# EAGLE design GaN-amplifier (EAGLE 7.7.0)

## Sheet 1 of 2
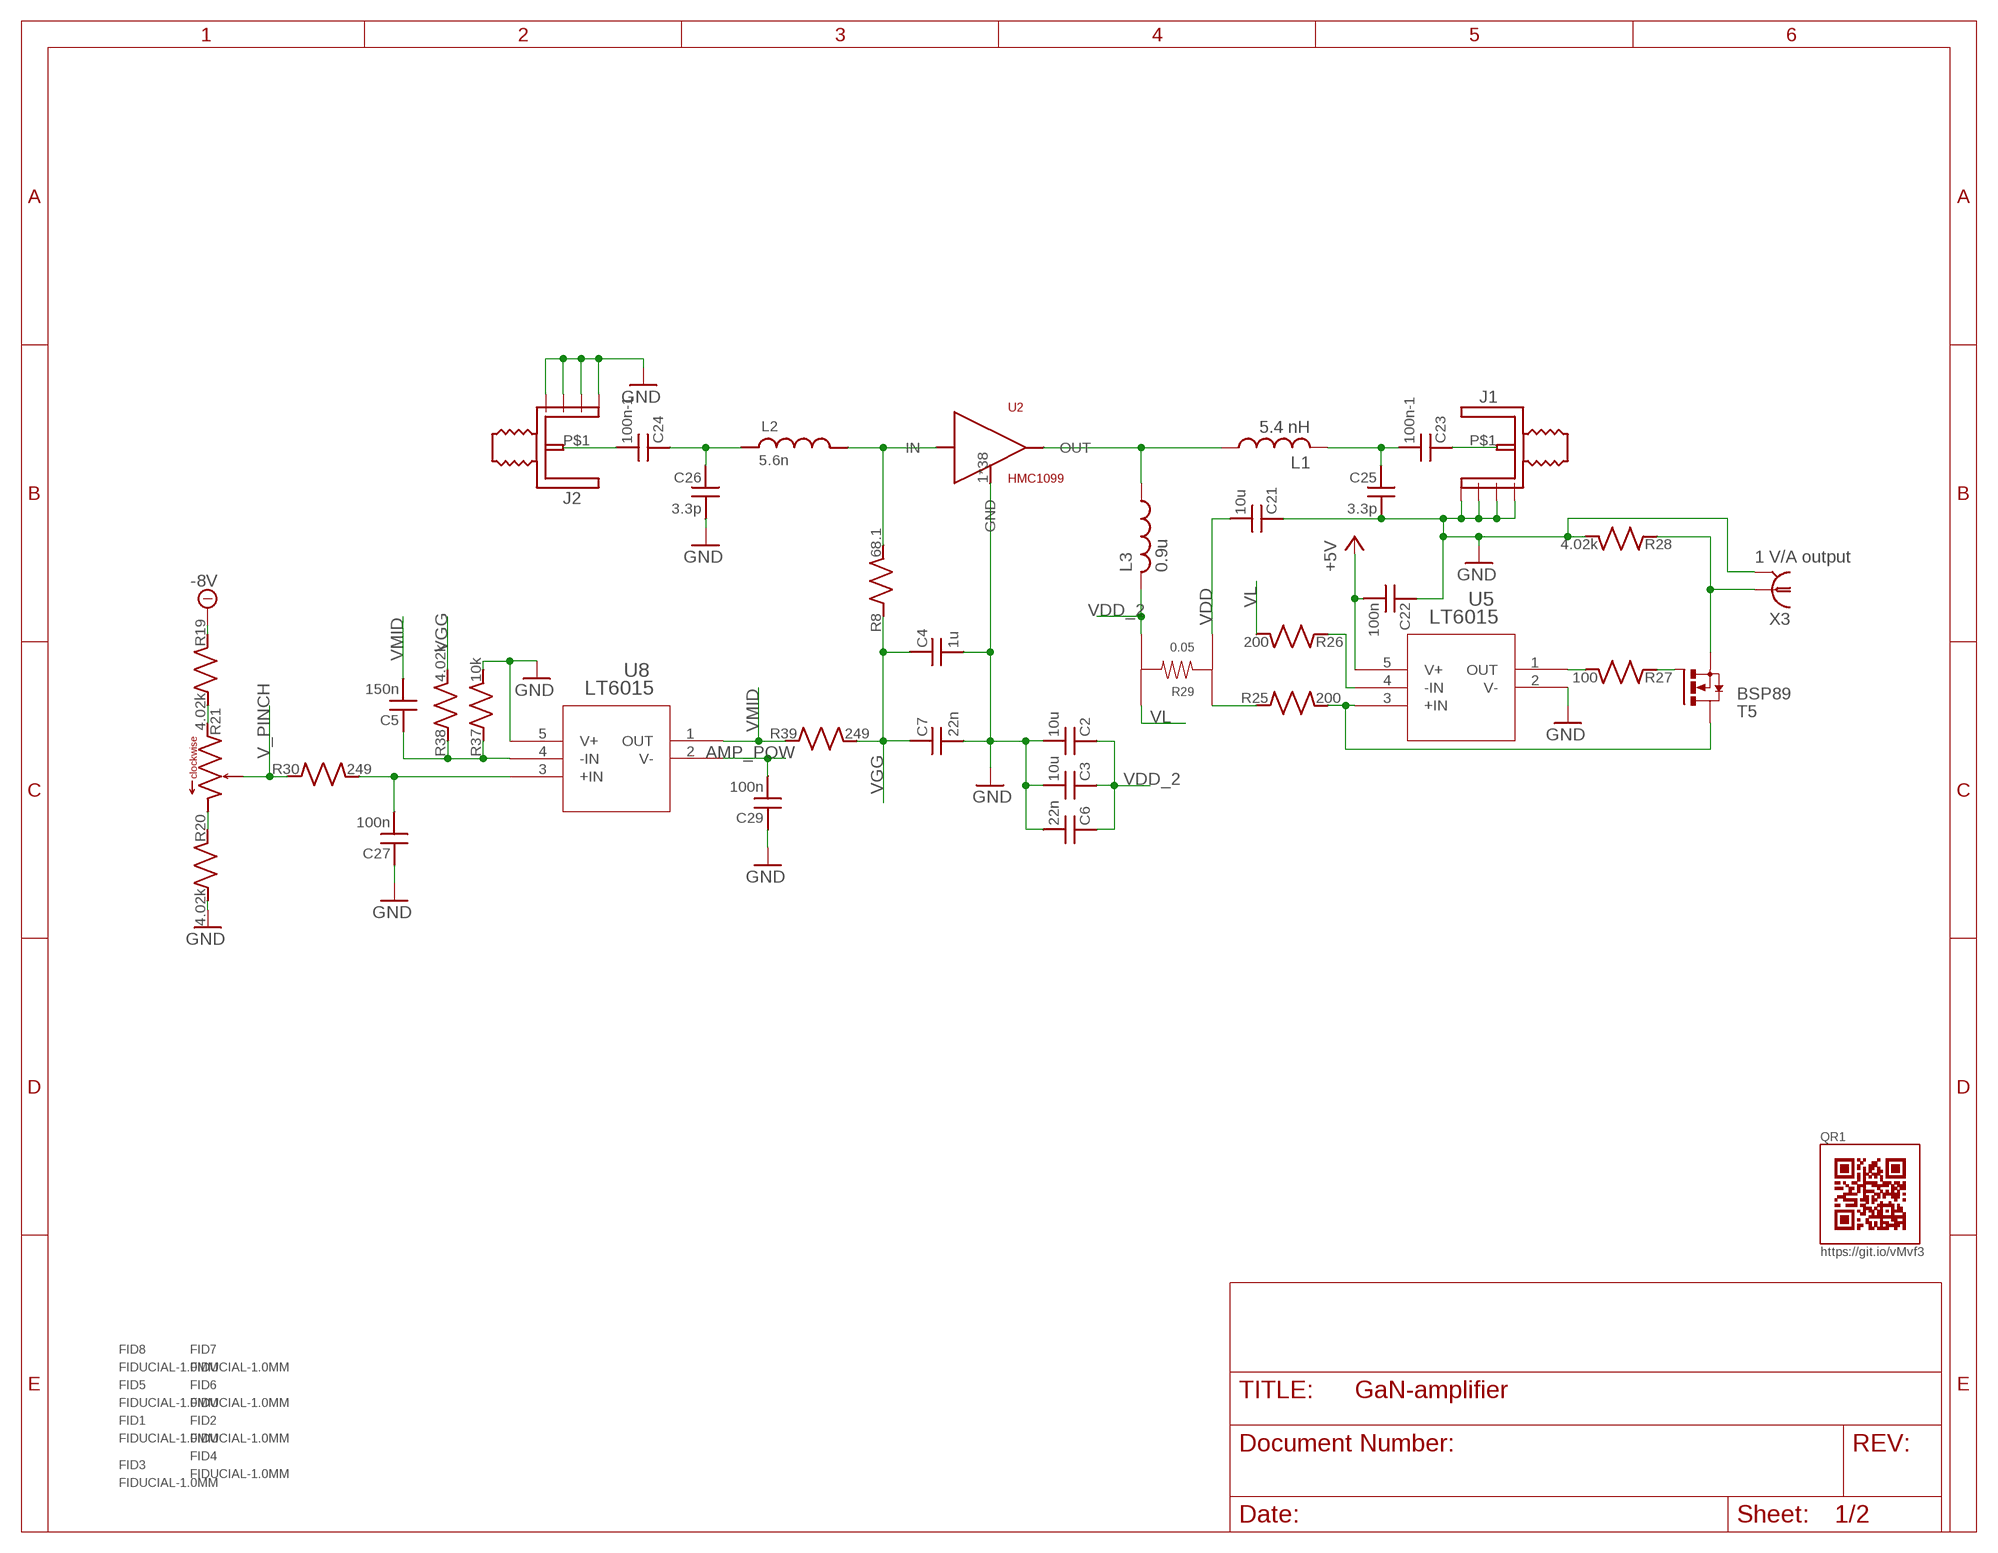
[diagram p0: schematic, sheet 1]

### Parts
C2  10u  C_MLCC_SMDCMLCC_1210  [C_MLCC_1210]
C3  10u  C_MLCC_SMDCMLCC_1210  [C_MLCC_1210]
C4  1u  C_MLCC_SMDCMLCC_0603  [C_MLCC_0603]
C5  150n  C_MLCC_SMDCMLCC_0603  [C_MLCC_0603]
C6  22n  C_MLCC_SMDCMLCC_0603  [C_MLCC_0603]
C7  22n  C_MLCC_SMDCMLCC_0603  [C_MLCC_0603]
C21  10u  C_MLCC_SMDCMLCC_1210  [C_MLCC_1210]
C22  100n  C_MLCC_SMDCMLCC_0603  [C_MLCC_0603]
C23  100n-1  C_MLCC_SMDCMLCC_0402  [C_MLCC_0402]
C24  100n-1  C_MLCC_SMDCMLCC_0402  [C_MLCC_0402]
C25  3.3p  C_MLCC_SMDCMLCC_0603  [C_MLCC_0603]
C26  3.3p  C_MLCC_SMDCMLCC_0603  [C_MLCC_0603]
C27  100n  C_MLCC_SMDCMLCC_0603  [C_MLCC_0603]
C29  100n  C_MLCC_SMDCMLCC_0603  [C_MLCC_0603]
FID1  FIDUCIAL-1.0MM  [FID_1.0MM]
FID2  FIDUCIAL-1.0MM  [FID_1.0MM]
FID3  FIDUCIAL-1.0MM  [FID_1.0MM]
FID4  FIDUCIAL-1.0MM  [FID_1.0MM]
FID5  FIDUCIAL-1.0MM  [FID_1.0MM]
FID6  FIDUCIAL-1.0MM  [FID_1.0MM]
FID7  FIDUCIAL-1.0MM  [FID_1.0MM]
FID8  FIDUCIAL-1.0MM  [FID_1.0MM]
J1  JOHNSON_SMA_EDGE_LAUNCH_142-0701-851  [JOHNSON_SMA_EDGE_LAUNCH_142-0701-851]
J2  JOHNSON_SMA_EDGE_LAUNCH_142-0701-851  [JOHNSON_SMA_EDGE_LAUNCH_142-0701-851]
L1  5.4 nH  0906-XX  [0906]
L2  5.6n  L_FERRITE_SMDLFERRITE_0402  [R_0402]
L3  0.9u  1008AF-XX  [1008]
QR1  QR-HTTPS://GIT.IO/VMVF3-LIGHT-SILK  [QR-HTTPS://GIT.IO/VMVF3-LIGHT-SILK]
R8  68.1  R_SMDR0603  [R_0603]
R19  4.02k  R_SMDR0603  [R_0603]
R20  4.02k  R_SMDR0603  [R_0603]
R21  R_TRIM  [RJ24]
R25  200  R_SMDR0603  [R_0603]
R26  200  R_SMDR0603  [R_0603]
R27  100  R_SMDR0603  [R_0603]
R28  4.02k  R_SMDR0603  [R_0603]
R29  0.05  RES_KELVIN  [1206_KELVIN]
R30  249  R_SMDR0603  [R_0603]
R37  10k  R_SMDR0603  [R_0603]
R38  4.02k  R_SMDR0603  [R_0603]
R39  249  R_SMDR0603  [R_0603]
T5  BSP89  [PG-SOT-223]
U2  HMC1099  [HCP-32-2]
U5  LT6015  LT6015HS5  [TSOT-23_S5]
U8  LT6015  LT6015HS5  [TSOT-23_S5]
X3  BNC-V  [BNC-V]

### Nets
+5V: C22.P$2 U5.5(V+) ; also sheet 2
-8V: R19.P$1 ; also sheet 2
AMP_POW: C29.P$2 U8.2(V-) ; also sheet 2
GND: C2.P$2 C3.P$2 C4.P$2 C6.P$2 C7.P$2 C21.P$1 C22.P$1 C25.P$2 C26.P$2 C27.P$1 C29.P$1 J1.P$2(GND1) J1.P$3(GND) J1.P$4(GND2) J1.P$5(GND3) J2.P$2(GND1) J2.P$3(GND) J2.P$4(GND2) J2.P$5(GND3) R20.P$2 R28.P$2 R37.P$2 U2.1(GND) U2.2(GND) U2.3(GND) U2.6(GND) U2.7(GND) U2.8(GND) U2.9(GND) U2.10(GND) U2.11(GND) U2.12(GND) U2.13(GND) U2.14(GND) U2.15(GND) U2.16(GND) U2.17(GND) U2.18(GND) U2.19(GND) U2.22(GND) U2.23(GND) U2.24(GND) U2.25(GND) U2.26(GND) U2.27(GND) U2.28(GND) U2.29(GND) U2.30(GND) U2.31(GND) U2.32(GND) U2.33(GND) U2.34(GND) U2.35(GND) U2.36(GND) U2.37(GND) U2.38(GND) U2.39(GND) U2.40(GND) U2.41(GND) U2.42(GND) U5.2(V-) U8.5(V+) X3.2 ; also sheet 2
N$19: R19.P$2 R21.1
N$20: R20.P$1 R21.3
N$24: R25.P$2 T5.2(D) T5.4(D) U5.3(+IN)
N$25: R27.P$2 U5.1(OUT)
N$26: R27.P$1 T5.1(G)
N$27: R25.P$1 R29.P$1(V$1)
N$28: R28.P$1 T5.3(S) X3.1
N$29: R26.P$1 U5.4(-IN)
N$30: C23.P$1 J1.P$1
N$31: C24.P$2 J2.P$1
N$32: C5.P$1 R37.P$1 R38.P$1 U8.4(-IN)
N$33: C23.P$2 C25.P$1 L1.P$2
N$34: L1.P$1 L3.P$1 U2.20(OUT) U2.21(OUT)
N$35: C24.P$1 C26.P$1 L2.P$1
N$43: C27.P$2 R30.P$2 U8.3(+IN)
V_GATE: L2.P$2 R8.P$2 U2.4(IN) U2.5(IN)
V_PINCH: R21.2 R30.P$1 ; also sheet 2
VDD: C21.P$2 R29.P$3(I$1) ; also sheet 2
VDD_2: C2.P$1 C3.P$1 C6.P$1 L3.P$2 R29.P$4(I$2)
VGG: C4.P$1 C7.P$1 R8.P$1 R38.P$2 R39.P$2
VL: R26.P$2 R29.P$2(V$2)
VMID: C5.P$2 R39.P$1 U8.1(OUT)

### Notes on the sheet
- 1 V/A output

## Sheet 2 of 2
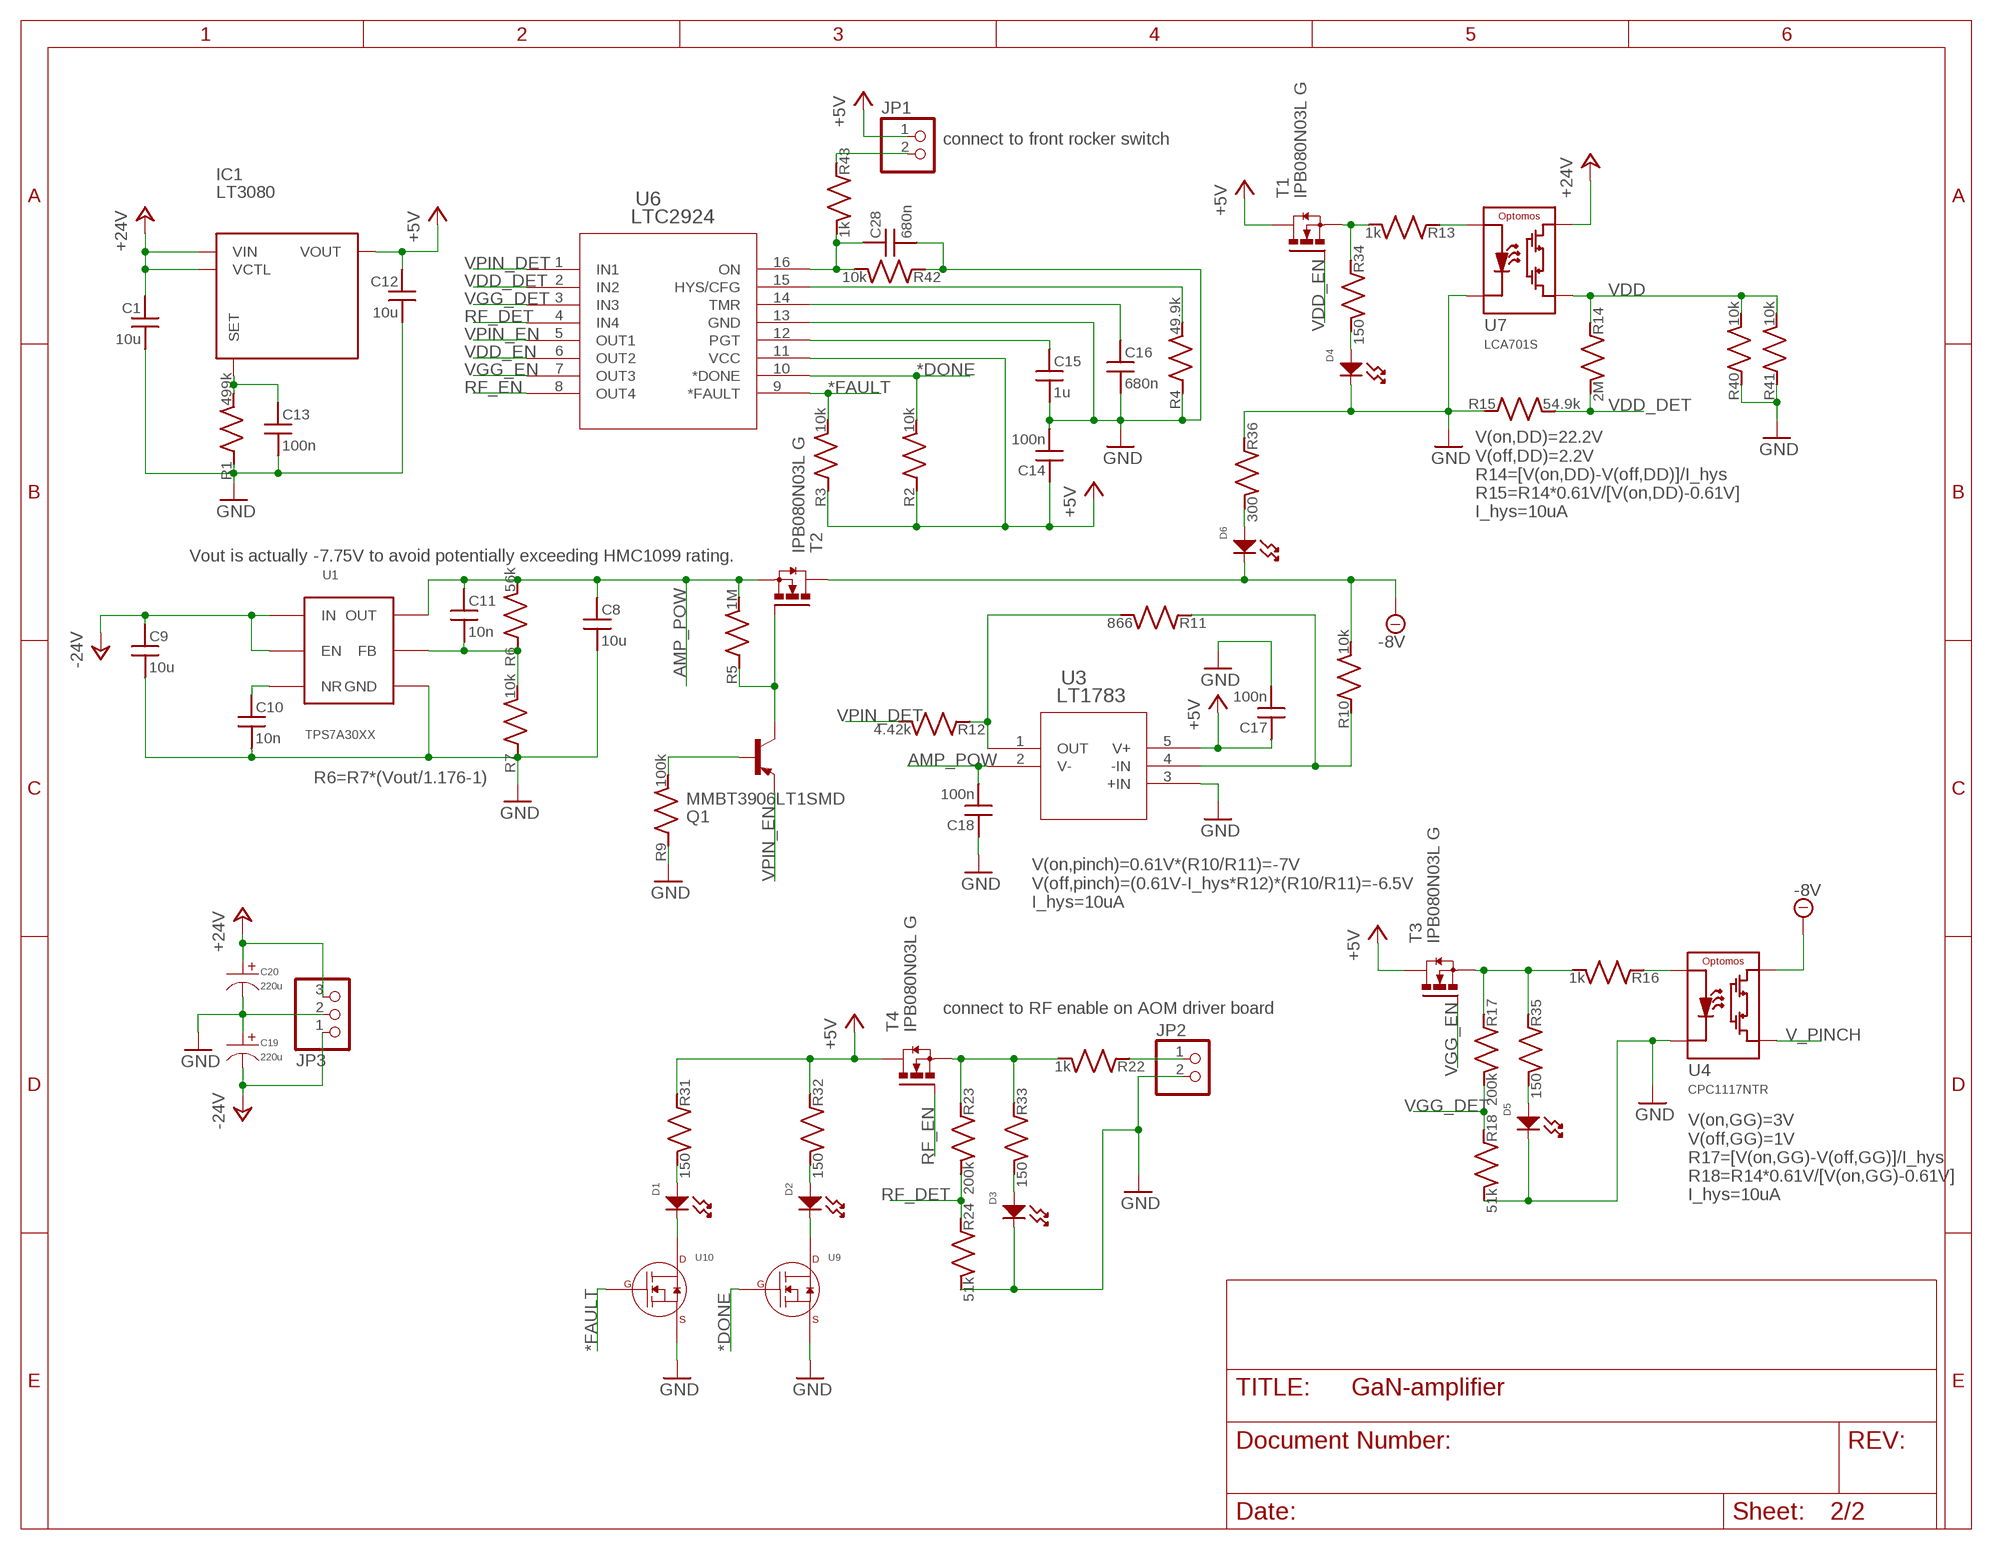
[diagram p1: schematic, sheet 2]

### Parts
C1  10u  C_MLCC_SMDCMLCC_1210  [C_MLCC_1210]
C8  10u  C_MLCC_SMDCMLCC_1210  [C_MLCC_1210]
C9  10u  C_MLCC_SMDCMLCC_1210  [C_MLCC_1210]
C10  10n  C_MLCC_SMDCMLCC_0402  [C_MLCC_0402]
C11  10n  C_MLCC_SMDCMLCC_0402  [C_MLCC_0402]
C12  10u  C_MLCC_SMDCMLCC_1210  [C_MLCC_1210]
C13  100n  C_MLCC_SMDCMLCC_0603  [C_MLCC_0603]
C14  100n  C_MLCC_SMDCMLCC_0603  [C_MLCC_0603]
C15  1u  C_MLCC_SMDCMLCC_0603  [C_MLCC_0603]
C16  680n  C_MLCC_SMDCMLCC_0603  [C_MLCC_0603]
C17  100n  C_MLCC_SMDCMLCC_0603  [C_MLCC_0603]
C18  100n  C_MLCC_SMDCMLCC_0603  [C_MLCC_0603]
C19  220u  CAPACITOR_P_10MM  [CP10MM]
C20  220u  CAPACITOR_P_10MM  [CP10MM]
C28  680n  C_MLCC_SMDCMLCC_0603  [C_MLCC_0603]
D1  LED_SINGLE-0603-GREEN  [LED0603]
D2  LED_SINGLE-0603-RED  [LED0603]
D3  LED_SINGLE-0603-GREEN  [LED0603]
D4  LED_SINGLE-0603-GREEN  [LED0603]
D5  LED_SINGLE-0603-GREEN  [LED0603]
D6  LED_SINGLE-0603-GREEN  [LED0603]
IC1  LT3080  [TO263-5]
JP1  PINHD-1X2  [1X02]
JP2  PINHD-1X2  [1X02]
JP3  PINHD-1X3  [1X03]
Q1  MMBT3906LT1SMD  [SOT23-BEC]
R1  499k  R_SMDR0603  [R_0603]
R2  10k  R_SMDR0603  [R_0603]
R3  10k  R_SMDR0603  [R_0603]
R4  49.9k  R_SMDR0603  [R_0603]
R5  1M  R_SMDR0603  [R_0603]
R6  56k  R_SMDR0402  [R_0402]
R7  10k  R_SMDR0402  [R_0402]
R9  100k  R_SMDR0603  [R_0603]
R10  10k  R_SMDR0603  [R_0603]
R11  866  R_SMDR0603  [R_0603]
R12  4.42k  R_SMDR0603  [R_0603]
R13  1k  R_SMDR0603  [R_0603]
R14  2M  R_SMDR0603  [R_0603]
R15  54.9k  R_SMDR0603  [R_0603]
R16  1k  R_SMDR0603  [R_0603]
R17  200k  R_SMDR0603  [R_0603]
R18  51k  R_SMDR0603  [R_0603]
R22  1k  R_SMDR0603  [R_0603]
R23  200k  R_SMDR0603  [R_0603]
R24  51k  R_SMDR0603  [R_0603]
R31  150  R_SMDR0603  [R_0603]
R32  150  R_SMDR0603  [R_0603]
R33  150  R_SMDR0603  [R_0603]
R34  150  R_SMDR0603  [R_0603]
R35  150  R_SMDR0603  [R_0603]
R36  300  R_SMDR0603  [R_0603]
R40  10k  R_SMDR0603  [R_0603]
R41  10k  R_SMDR0603  [R_0603]
R42  10k  R_SMDR0603  [R_0603]
R43  1k  R_SMDR0603  [R_0603]
T1  IPB080N03L G  IRL3714  [D2PACK]
T2  IPB080N03L G  IRL3714  [D2PACK]
T3  IPB080N03L G  IRL3714  [D2PACK]
T4  IPB080N03L G  IRL3714  [D2PACK]
U1  TPS7A30XX  [DGN]
U3  LT1783  LT1783HS5  [TSOT-23_S5]
U4  CPC1117NTR  [4-LEAD_SOP]
U6  LTC2924  LTC2924IGN  [SSOP-16_GN]
U7  LCA701S  [6-LEAD_SMT]
U9  N-CHANNEL_FET_BSS138_SOT-23-3  [SOT-23-3]
U10  N-CHANNEL_FET_BSS138_SOT-23-3  [SOT-23-3]

### Nets
*DONE: R2.P$2 U6.10(*DONE) U9.P$1(GATE)
*FAULT: R3.P$2 U6.9(*FAULT) U10.P$1(GATE)
+5V: C12.P$1 C14.P$1 C17.P$1 IC1.3(VOUT) IC1.6(VOUT) JP1.1 R2.P$1 R3.P$1 R31.P$1 R32.P$1 T1.2(D) T3.2(D) T4.2(D) U3.5(V+) U6.11(VCC) ; also sheet 1
+24V: C1.P$1 C20.P$1 IC1.4(VCTL) IC1.5(VIN) JP3.3 U7.6(L+)
-8V: D6.CATHODE R10.P$2 T2.2(D) U4.P$4(L+) ; also sheet 1
-24V: C9.P$1 C19.P$2 JP3.1 U1.EN U1.IN
AMP_POW: C8.P$1 C11.P$1 C18.P$2 R5.P$2 R6.P$2 T2.3(S) U1.OUT U3.2(V-) ; also sheet 1
GND: C1.P$2 C8.P$2 C9.P$2 C10.P$2 C12.P$2 C13.P$2 C14.P$2 C15.P$2 C16.P$2 C17.P$2 C18.P$1 C19.P$1 C20.P$2 C28.P$2 D3.CATHODE D4.CATHODE D5.CATHODE JP2.2 JP3.2 R1.P$1 R4.P$1 R7.P$1 R9.P$1 R15.P$1 R18.P$2 R24.P$2 R36.P$1 R40.P$1 R41.P$1 R42.P$1 U1.GND U1.GND1(GND) U3.3(+IN) U4.P$2(C-) U6.13(GND) U7.2(C-) U9.P$2(SOURCE) U10.P$2(SOURCE) ; also sheet 1
N$1: C13.P$1 IC1.2(SET) R1.P$2
N$2: D1.CATHODE U10.P$3(DRAIN)
N$3: D2.CATHODE U9.P$3(DRAIN)
N$4: JP1.2 R43.P$1
N$5: C16.P$1 U6.14(TMR)
N$6: R4.P$2 U6.15(HYS/CFG)
N$7: C15.P$1 U6.12(PGT)
N$8: R11.P$2 R12.P$1 U3.1(OUT)
N$9: Q1.C R5.P$1 T2.1(G)
N$10: Q1.B R9.P$2
N$11: R13.P$2 R34.P$1 T1.3(S)
N$12: R10.P$1 R11.P$1 U3.4(-IN)
N$13: R13.P$1 U7.1(C+)
N$14: R16.P$2 R17.P$1 R35.P$1 T3.3(S)
N$15: C11.P$2 R6.P$1 R7.P$2 U1.FB
N$16: R16.P$1 U4.P$1(C+)
N$17: C10.P$1 U1.NR/SS(NR)
N$18: D1.ANODE R31.P$2
N$21: R22.P$2 R23.P$1 R33.P$1 T4.3(S)
N$22: JP2.1 R22.P$1
N$37: D2.ANODE R32.P$2
N$38: D4.ANODE R34.P$2
N$39: D3.ANODE R33.P$2
N$40: D5.ANODE R35.P$2
N$41: D6.ANODE R36.P$2
N$44: C28.P$1 R42.P$2 R43.P$2 U6.16(ON)
RF_DET: R23.P$2 R24.P$1 U6.4(IN4)
RF_EN: T4.1(G) U6.8(OUT4)
V_PINCH: U4.P$3(L-) ; also sheet 1
VDD: R14.P$1 R40.P$2 R41.P$2 U7.4(L-) ; also sheet 1
VDD_DET: R14.P$2 R15.P$2 U6.2(IN2)
VDD_EN: T1.1(G) U6.6(OUT2)
VGG_DET: R17.P$2 R18.P$1 U6.3(IN3)
VGG_EN: T3.1(G) U6.7(OUT3)
VPIN_DET: R12.P$2 U6.1(IN1)
VPIN_EN: Q1.E U6.5(OUT1)

### Notes on the sheet
- connect to front rocker switch
- V(on,DD)=22.2V
  V(off,DD)=2.2V
  R14=[V(on,DD)-V(off,DD)]/I_hys
  R15=R14*0.61V/[V(on,DD)-0.61V]
  I_hys=10uA
- Vout is actually -7.75V to avoid potentially exceeding HMC1099 rating.
- R6=R7*(Vout/1.176-1)
- V(on,pinch)=0.61V*(R10/R11)=-7V
  V(off,pinch)=(0.61V-I_hys*R12)*(R10/R11)=-6.5V
  I_hys=10uA
- connect to RF enable on AOM driver board
- V(on,GG)=3V
  V(off,GG)=1V
  R17=[V(on,GG)-V(off,GG)]/I_hys
  R18=R14*0.61V/[V(on,GG)-0.61V]
  I_hys=10uA

## Library data of the parts
C1-C3 C8 C9 C12 C21 = jqi_passives:C_MLCC_SMD; PARTNO: CL32B106KBJNNNE
C4 C15 = jqi_passives:C_MLCC_SMD; PARTNO: CL10B105KA8NNNC
C5 = jqi_passives:C_MLCC_SMD; PARTNO: CL10B154KO8NNNC
C6 C7 = jqi_passives:C_MLCC_SMD; PARTNO: CL10B223KB8NNNC
C10 C11 = jqi_passives:C_MLCC_SMD; PARTNO: CL05B103KB5NNNC
C13 C14 C17 C18 C22 C27 C29 = jqi_passives:C_MLCC_SMD; PARTNO: CL10B104KB8SFNC
C16 C28 = jqi_passives:C_MLCC_SMD; PARTNO: CL10B684KO8NFNC
C19 C20 = MF_Passives:CAPACITOR_P: Library: MF_Passives Description: Device for Polarized Capacitors. Manufacture part number (MPN), Voltage Rating, and Tolerance can be added via Attributes. Check https://factory.macrofab.com/parts for the house parts list.; PARTNO: MF-CAP-10MM-220uF; POPULATE: 1
C23 C24 = jqi_passives:C_MLCC_SMD; PARTNO: 0402BB104KW500
C25 C26 = jqi_passives:C_MLCC_SMD; PARTNO: 600S3R3CT250XT
D1 D3-D6 = MF_LEDs:LED_SINGLE: Library: MF_LEDs Description: Device for Single LED Packages. Manufacture part number (MFG#) can be added via Attributes.; HOUSEPART: YES; MPN: MF-LED-0603-GREEN; POPULATE: 1; URL: https://factory.macrofab.com/part/MF-LED-0603-GREEN; VALUE: MF-LED-0603-GREEN
D2 = MF_LEDs:LED_SINGLE: Library: MF_LEDs Description: Device for Single LED Packages. Manufacture part number (MFG#) can be added via Attributes.; HOUSEPART: YES; MPN: MF-LED-0603-RED; POPULATE: 1; URL: https://factory.macrofab.com/part/MF-LED-0603-RED; VALUE: MF-LED-0603-RED
FID1-FID8 = fiducials-jqi:FIDUCIAL: SMD Fiducials for optical recognition systems
IC1 = regulator-jqi:LT3080: LT3080 adjustable positive low-noise 1.1A regulator; PARTNO: LT3080EQ#PBF
J1 J2 = connector-jqi:JOHNSON_SMA_EDGE_LAUNCH_142-0701-851; PARTNO: 142-0701-851
JP1 JP2 = pinhead:PINHD-1X2: PIN HEADER; PARTNO: 640456-2
JP3 = pinhead:PINHD-1X3: PIN HEADER; PARTNO: 640456-3
L1 = coilcraft-jqi:0906-XX: Microspring, air-core inductor. 0906 package; COILCRAFT: 0906; PARTNO: 0906-5JLB
L2 = jqi_passives:L_FERRITE_SMD; PARTNO: 0402CS-5N6XJLU
L3 = coilcraft-jqi:1008AF-XX: low resistance, high current, 1008 chip inductor; COILCRAFT: 1008AF; PARTNO: 1008AF-901XKLC
Q1 = transistor-pnp:MMBT3906*: PNP Transistror; PARTNO: MF-DSC-SOT233-MMBT3906
QR1 = QR-git.io-vMvf3:QR-HTTPS://GIT.IO/VMVF3: QR Code pointing to https://git.io/vMvf3 -WIRE if a wire-based rendering for silks screens lighter than the solder mask. -LIGHT-SILK is a rectangle-based rendering for silks lighter than the solder mask. -DARK-SILK is a rectangle-based rendering for silks darker than the solder mask.; QR_DEST: https://git.io/vMvf3; QR_DEST_SHORT: git.io/vMvf3
R1 = jqi_passives:R_SMD; PARTNO: ERJ-3EKF4993V
R2 R3 R10 R40-R42 = jqi_passives:R_SMD; PARTNO: ERJ-3EKF1002V
R4 = jqi_passives:R_SMD; PARTNO: ERJ-3EKF4992V
R5 = jqi_passives:R_SMD; PARTNO: ERJ-3EKF1004V
R6 = jqi_passives:R_SMD; PARTNO: ERJ-2RKF5602X
R7 = jqi_passives:R_SMD; PARTNO: ERJ-2RKF1002X
R8 = jqi_passives:R_SMD; PARTNO: ERJ-3EKF68R1V
R9 = jqi_passives:R_SMD; PARTNO: ERJ-3EKF1003V
R11 = jqi_passives:R_SMD; PARTNO: ERJ-3EKF8660V
R12 = jqi_passives:R_SMD; PARTNO: ERJ-3EKF4421V
R13 R16 R22 R43 = jqi_passives:R_SMD; PARTNO: ERJ-3EKF1001V
R14 = jqi_passives:R_SMD; PARTNO: ERJ-3EKF2004V
R15 = jqi_passives:R_SMD; PARTNO: ERJ-3EKF5492V
R17 R23 = jqi_passives:R_SMD; PARTNO: ERJ-3EKF2003V
R18 R24 = jqi_passives:R_SMD; PARTNO: ERJ-3EKF5102V
R19 R20 R28 R38 = jqi_passives:R_SMD; PARTNO: TNPW06034K02BEEA
R21 = jqi_passives:R_TRIM: Trimpot; PARTNO: Y006910K0000J9L
R25 R26 = jqi_passives:R_SMD; PARTNO: TNPW0603200RBEEA
R27 = jqi_passives:R_SMD; PARTNO: ERJ-3EKF1000V
R29 = rlc-jqi:RES_KELVIN: Current Sense Resistor, Kelvin pad configuration; PARTNO: LVK12R050DER
R30 R39 = jqi_passives:R_SMD; PARTNO: TNPW0603249RBEEA
R31-R35 = jqi_passives:R_SMD; PARTNO: ERJ-3EKF1500V
R36 = jqi_passives:R_SMD; PARTNO: ERJ-PA3F3000V
R37 = jqi_passives:R_SMD; PARTNO: TNPW060310K0BEEA
T1-T4 = transistor-jqi:IRL3714: IRL3714, HEXFET Power MOSFET, N-channel; PARTNO: IPB080N03L G
T5 = transistor-jqi:BSP89: BSP89, N-channel, Small Signal Transistor; PARTNO: BSP89H6327XTSA1
U1 = regulator-jqi:TPS7A30XX: Ultra-low noise adjustable negative regulator, 200mA; PARTNO: TPS7A3001DGNR
U2 = rf-jqi:HMC1099: 10W GaN Power Amplifier; ANALOGDEVICES: HMC1099; PARTNO: HMC1099LP5DE
U3 = linear-technology-jqi:LT1783HS5: LT1783, over-the-top, micropower, rail-to-rail op-amp; COPYRIGHT: Copyright C 2016 Accelerated Designs. All rights reserved; MANUFACTURER_PART_NUMBER: lt1783hs5; PARTNO: LT1783HS5#TRMPBF; VENDOR: Linear Technologies
U4 = transistor-jqi:CPC1117NTR: CPC1117NTR, normally-closed optomos, 60V blocking voltage, 150 mA; PARTNO: CPC1117NTR
U5 U8 = linear-technology-jqi:LT6015HS5: LT6015, over-the-top, low-power, precision op-amp; PARTNO: LT6015HS5#TRMPBF
U6 = linear-technology-jqi:LTC2924IGN: LTC2924, quad power supply sequencer; MANUFACTURER_PART_NUMBER: ltc2924ign; PARTNO: LTC2924IGN#PBF; VENDOR: Linear Technology
U7 = transistor-jqi:LCA701S: LCA701S, normally-open optomos, 100V blocking voltage, 1.5 A; PARTNO: LCA701S
U9 U10 = MF_Discrete_Semiconductor:N-CHANNEL_FET: Library: MF_Discrete_Semiconductor Description: Device for Single N-Channel Mosfet. Manufacture part number (MFG#) can be added via Attributes.; HOUSEPART: YES; MPN: MF-DSC-SOT233-BSS138; POPULATE: 1; URL: https://factory.macrofab.com/part/MF-DSC-SOT233-BSS138; VALUE: MF-DSC-SOT233-BSS138
X3 = connector-jqi:BNC: BNC Connector.; PARTNO: 5227222-3

## Board
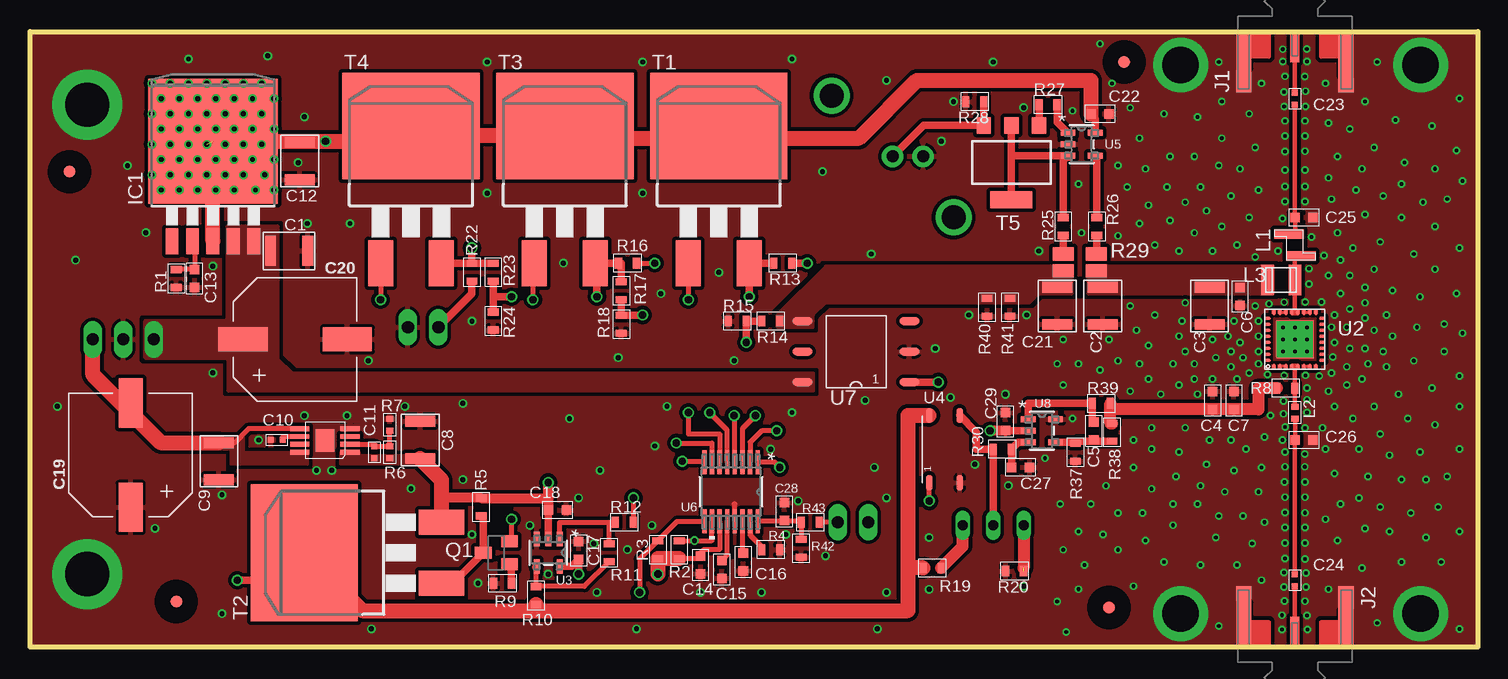
[diagram p2: board, top side]
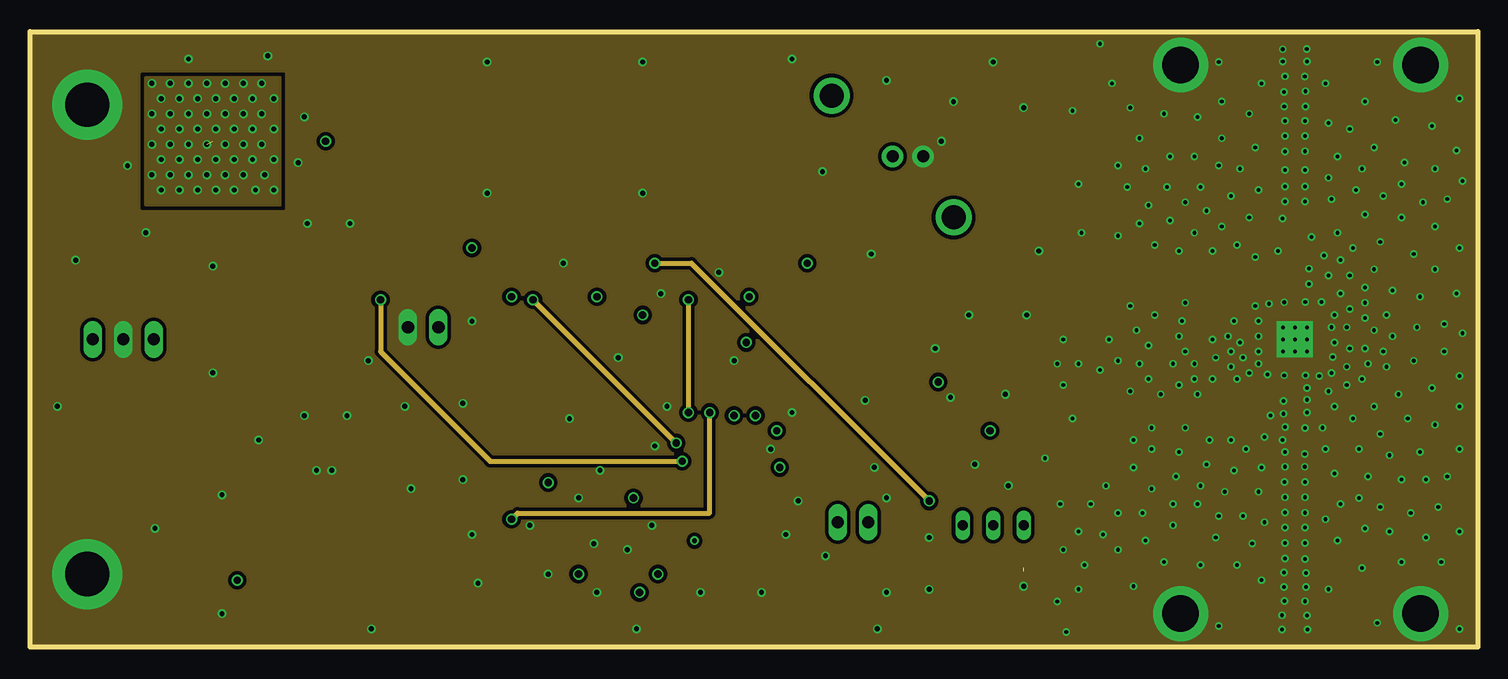
[diagram p3: board, inner layer Route2]
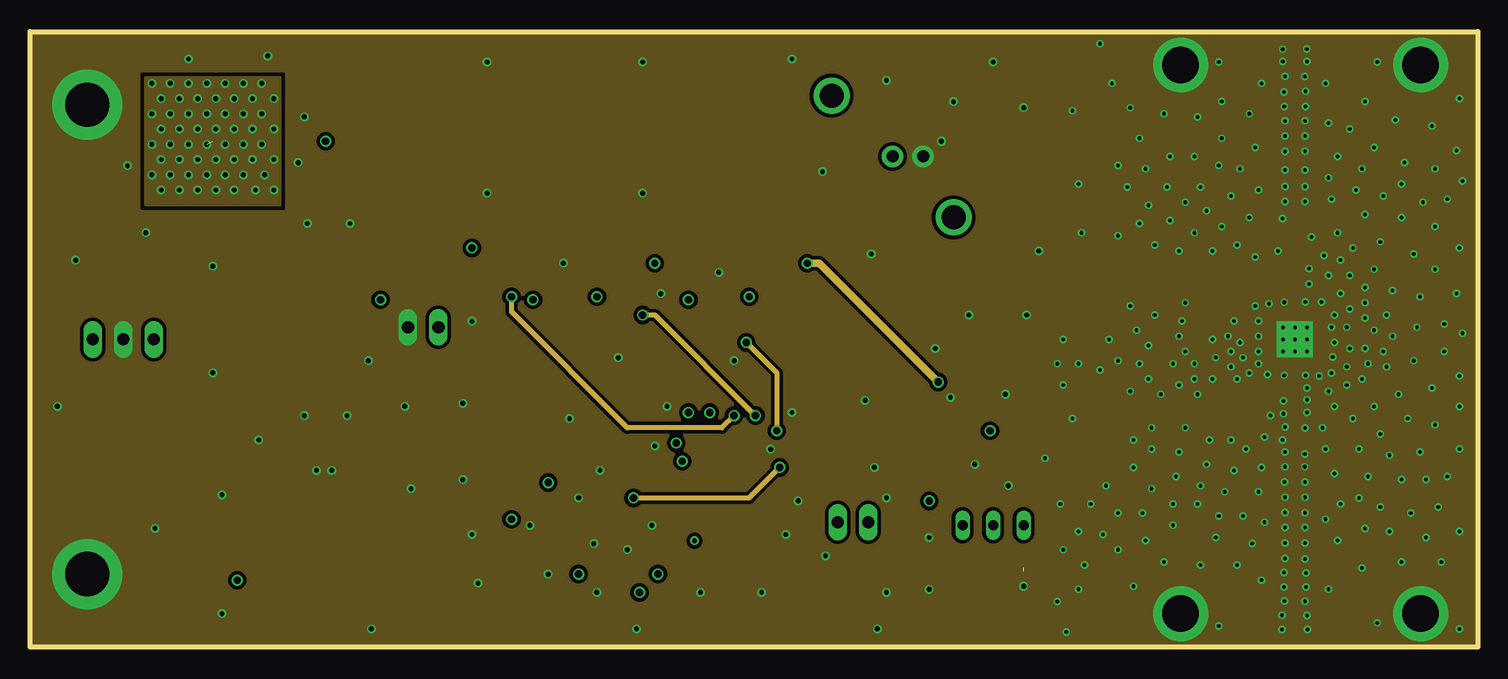
[diagram p4: board, inner layer Route15]
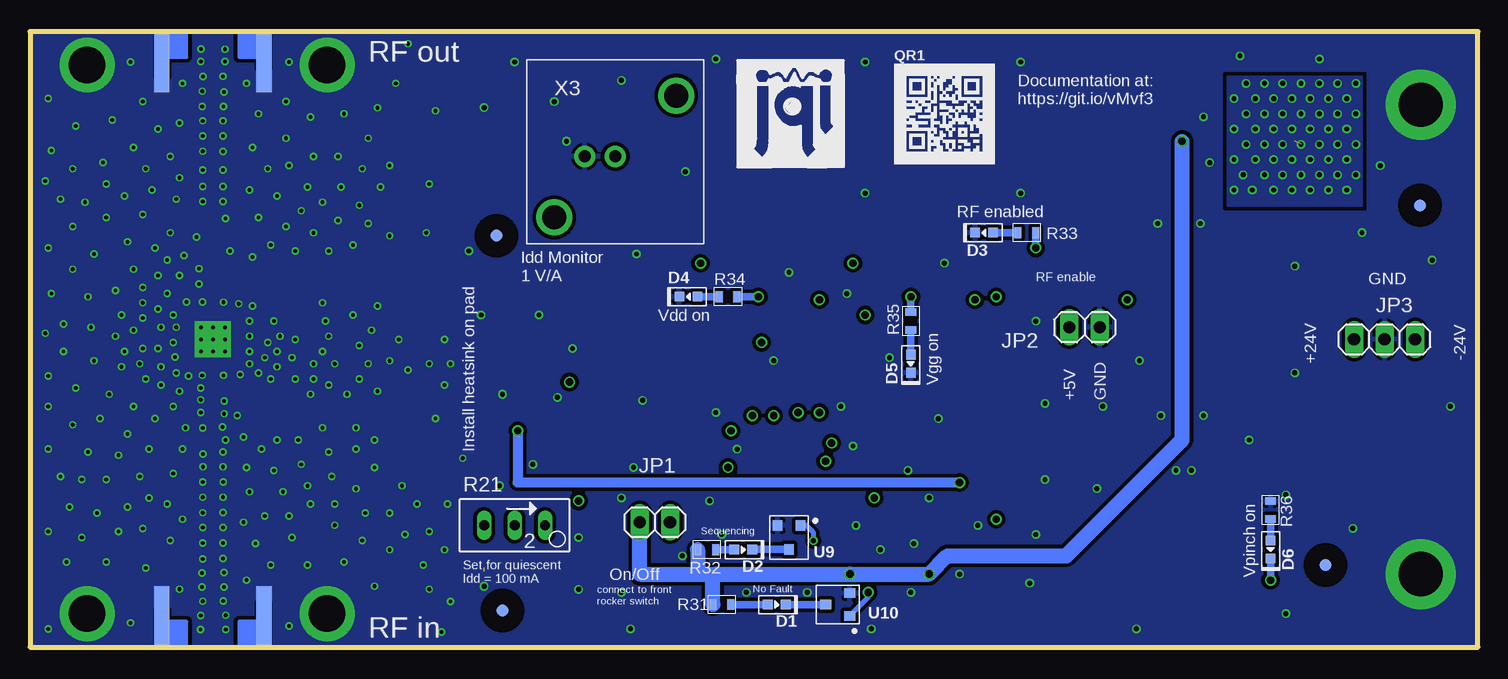
[diagram p5: board, bottom side, seen from below]

Size 120.65 x 51.31 mm. Coordinates in mm from the lower left corner, seen from the top.
Outline: 0,0 0,51.31 120.65,51.31 120.65,0 0,0
Copper layers (1*2*15*16): Top 0.035mm / dielectric 0.23mm / Route2 0.035mm / dielectric 0.93mm / Route15 0.035mm / dielectric 0.23mm / Bottom 0.035mm
Design rules "MF_Standard_4_Layer *": minimum track width 5mil, minimum drill 12mil, track to track 5mil, track to pad 5mil, pad to pad 5mil, via to via 5mil, smd to smd 0mil, copper to edge 0mil, drill to drill 10mil, minimum pad ring 6mil, minimum via ring 6mil, stop-mask expansion 2mil, vias tented up to drill 25mil, thermal gap 10mil

### Footprints (pad centres in the part's own frame; a part is rotated, then mirrored left to right if it is on the bottom)
C_MLCC_1210 = smd 0.9 x 2.5: P$1 -1.55,0; P$2 1.55,0
C_MLCC_0603 = smd 0.8 x 0.8: P$1 -0.75,0; P$2 0.75,0
C_MLCC_0402 = smd 0.5 x 0.5: P$1 -0.5,0; P$2 0.5,0
CP10MM = smd 2 x 4.1: P$1 0,-4.35; P$2 0,4.35
LED0603 = smd 0.8 x 0.8: ANODE 0.75,0; CATHODE -0.75,0
FID_1.0MM = smd 1 x 1: FID 0,0
TO263-5 = smd 1.067 x 2.159: 1 -3.404,-5.791; 2 -1.702,-5.791; 3 0,-5.791; 4 1.702,-5.791; 5 3.404,-5.791 | smd 10.8 x 10.41: 6 0,2.54
JOHNSON_SMA_EDGE_LAUNCH_142-0701-851 = smd 2.54 x 0.762: P$1 -1.27,0 | smd 5.08 x 1.27: P$2 -2.54,4.255; P$3 -2.54,-4.255 | smd 5.08 x 1.27 bottom: P$4 -2.54,4.255; P$5 -2.54,-4.255
1X02 = drill 1.016 long: 1 -1.27,0; 2 1.27,0
1X03 = drill 1.016 long: 1 -2.54,0; 2 0,0; 3 2.54,0
0906 = smd 0.787 x 2.464: P$1 -0.914,-0.508; P$2 0.914,0.508
R_0402 = smd 0.5 x 0.6: P$1 -0.5,0; P$2 0.5,0
1008 = smd 1.016 x 2.54: P$1 -1.143,0; P$2 1.143,0
SOT23-BEC = smd 1 x 1.4: B -0.95,-1.1; C 0,1.1; E 0.95,-1.1
R_0603 = smd 0.6 x 0.9: P$1 -0.75,0; P$2 0.75,0
RJ24 = drill 0.813 long: 1 2.54,0; 2 0,0; 3 -2.54,0
1206_KELVIN = smd 1.75 x 1.1: P$1 0,0; P$2 2.75,0; P$3 0,-1.4; P$4 2.75,-1.4
D2PACK = smd 2.083 x 3.81: 1 -2.54,-8.89; 3 2.54,-8.89 | smd 11.43 x 8.89: 2 0,2.54
PG-SOT-223 = smd 1.2 x 1.4: 1 -2.311,-3.099; 2 0,-3.099; 3 2.311,-3.099 | smd 3.5 x 1.4: 4 0,3.099
DGN = smd 1.6 x 0.4: DNC 4.2,-0.65; EN 4.2,-1.95; FB 0,-0.65; GND1 0,-1.95; IN 4.2,0; NC 0,-1.3; NR/SS 4.2,-1.3; OUT 0,0 | smd 1.55 x 1.9: GND 2.1,-0.975
HCP-32-2 = smd 0.5 x 0.25: 1 -2.25,1.75; 2 -2.25,1.25; 3 -2.25,0.75; 4 -2.25,0.25; 5 -2.25,-0.25; 6 -2.25,-0.75; 7 -2.25,-1.25; 8 -2.25,-1.75; 17 2.25,-1.75; 18 2.25,-1.25; 19 2.25,-0.75; 20 2.25,-0.25; 21 2.25,0.25; 22 2.25,0.75; 23 2.25,1.25; 24 2.25,1.75 | smd 0.25 x 0.5: 9 -1.75,-2.25; 10 -1.25,-2.25; 11 -0.75,-2.25; 12 -0.25,-2.25; 13 0.25,-2.25; 14 0.75,-2.25; 15 1.25,-2.25; 16 1.75,-2.25; 25 1.75,2.25; 26 1.25,2.25; 27 0.75,2.25; 28 0.25,2.25; 29 -0.25,2.25; 30 -0.75,2.25; 31 -1.25,2.25; 32 -1.75,2.25 | smd 3.15 x 3.15: 33 0,0 | drill 0.305 pad 1 square: 34 0,0; 35 0,1; 36 -1,1; 37 -1,0; 38 -1,-1; 39 0,-1; 40 1,-1; 41 1,0; 42 1,1
TSOT-23_S5 = smd 1.219 x 0.508: 1 -1.143,0.95; 2 -1.143,0; 3 -1.143,-0.95; 4 1.143,-0.95; 5 1.143,0.95
4-LEAD_SOP = smd 1.3 x 0.551: P$1 -2.8,1.27; P$2 -2.8,-1.27; P$3 2.8,-1.27; P$4 2.8,1.27
SSOP-16_GN = smd 1.981 x 0.356: 1 -2.464,2.223; 2 -2.464,1.587; 3 -2.464,0.953; 4 -2.464,0.318; 5 -2.464,-0.318; 6 -2.464,-0.953; 7 -2.464,-1.587; 8 -2.464,-2.223; 9 2.464,-2.223; 10 2.464,-1.587; 11 2.464,-0.953; 12 2.464,-0.318; 13 2.464,0.318; 14 2.464,0.953; 15 2.464,1.587; 16 2.464,2.223
6-LEAD_SMT = smd 1.65 x 0.65: 1 -4.45,2.54; 2 -4.45,0; 3 -4.45,-2.54; 4 4.45,-2.54; 5 4.45,0; 6 4.45,2.54
SOT-23-3 = smd 0.9 x 0.8: P$1 -1,0.95; P$2 -1,-0.95; P$3 1,0
BNC-V = drill 1 pad 1.778: 1 0,0; 2 -2.54,0 | drill 2 pad 2.032: ANCHOR1 -5.08,-5.08; ANCHOR2 5.08,5.08

### Placement (x,y rotation side)
C1  21.59,33.02 0 top
C2  89.41,28.45 270 top
C3  98.3,28.45 270 top
C4  98.55,20.57 90 top
C5  88.65,18.03 90 top
C6  100.84,29.21 270 top
C7  100.33,20.57 90 top
C8  32.51,17.27 90 top
C9  15.75,15.49 270 top
C10  20.57,17.27 180 top
C11  28.7,16.26 90 top
C12  22.48,40.51 270 top
C13  13.72,30.73 270 top
C14  55.88,6.86 270 top
C15  57.66,6.48 270 top
C16  59.44,7.11 270 top
C17  45.72,8.06 90 top
C18  43.94,11.43 180 top
C19  8.38,16 0 top
C20  22.1,25.65 270 top
C21  85.6,28.45 90 top
C22  89.15,44.45 180 top
C23  105.41,45.72 270 top
C24  105.41,5.59 270 top
C25  106.17,35.81 0 top
C26  106.17,17.27 0 top
C27  82.55,14.99 180 top
C28  62.87,11.3 90 top
C29  81.28,18.8 270 top
D1  58.42,3.56 180 bottom
D2  61.21,8.13 180 bottom
D3  41.15,34.54 0 bottom
D4  65.79,29.21 0 bottom
D5  47.24,23.62 90 bottom
D6  17.27,8.13 90 bottom
FID1  12.19,3.81 0 top
FID2  3.3,39.62 0 top
FID3  91.19,48.77 0 top
FID4  89.92,3.3 0 top
FID5  4.83,36.83 0 bottom
FID6  12.7,6.86 0 bottom
FID7  81.79,34.29 0 bottom
FID8  81.28,3.05 0 bottom
IC1  15.24,39.62 0 top
J1  105.41,51.31 90 top
J2  105.41,0 270 top
JP1  68.58,10.41 0 bottom
JP2  32.77,26.67 0 bottom
JP3  7.77,25.65 180 bottom
L1  105.41,33.53 90 top
L2  105.41,19.56 90 top
L3  104.27,30.61 180 top
Q1  38.86,7.87 90 top
QR1  44.45,44.45 0 bottom
R1  12.19,30.73 90 top
R2  54.1,8.13 90 top
R3  52.32,8.13 90 top
R4  61.72,8.13 180 top
R5  37.59,11.68 90 top
R6  29.97,16.26 270 top
R7  29.97,18.54 270 top
R8  104.65,21.59 0 top
R9  39.37,5.33 0 top
R10  42.16,4.32 270 top
R11  48.26,7.87 90 top
R12  49.53,10.41 0 top
R13  62.74,32 180 top
R14  61.72,27.18 180 top
R15  58.93,27.18 0 top
R16  49.78,32 180 top
R17  49.28,29.72 270 top
R18  49.28,26.92 270 top
R19  75.18,6.6 0 top
R20  82.04,6.35 180 top
R21  80.26,10.16 0 bottom
R22  36.83,31.24 90 top
R23  38.61,31.24 270 top
R24  38.61,27.18 270 top
R25  86.11,35.05 90 top
R26  88.9,35.05 270 top
R27  84.84,45.21 0 top
R28  78.74,45.47 180 top
R29  86.11,32.77 0 top
R30  81.03,16.51 0 top
R31  62.99,3.56 0 bottom
R32  64.26,8.13 0 bottom
R33  37.59,34.54 180 bottom
R34  62.48,29.21 180 bottom
R35  47.24,27.18 270 bottom
R36  17.27,11.43 270 bottom
R37  87.12,16.26 270 top
R38  90.17,17.91 90 top
R39  89.28,20.32 0 top
R40  79.76,28.32 90 top
R41  81.66,28.32 90 top
R42  64.26,8.25 90 top
R43  65.02,10.41 180 top
T1  57.4,40.89 0 top
T2  25.4,7.87 90 top
T3  44.58,40.89 0 top
T4  31.75,40.89 0 top
T5  81.79,40.39 180 top
U1  26.67,16.26 180 top
U2  105.41,25.65 90 top
U3  43.18,7.87 270 top
U4  76.2,16.51 90 top
U5  87.63,41.91 0 top
U6  58.42,12.95 270 top
U7  68.83,24.64 180 top
U8  84.33,18.03 0 top
U9  57.4,9.14 270 bottom
U10  53.34,3.56 180 bottom
U$2  [JQI_LOGO_NEGATIVE-SILKSCREEN]  61.72,40 0 bottom
X3  71.88,40.89 0 bottom

### Tracks (layer width: path | path; a pad name or v marks a point on that pad's centre or on a via)
*DONE  (via drill 0.41)
  Top 0.406: R2.P$2 v55.37,8.88 56.83,8.88 U6.10
  Bottom 0.406: v55.37,8.88 55.37,9.57 55.95,10.14 U9.P$1
*FAULT  (via drill 0.61)
  Top 0.406: U6.9 53.94,10.49 R3.P$2 50.8,7.35 v50.8,4.57
  Bottom 0.406: v50.8,4.57 50.8,4.15 U10.P$1
+5V  (via drill 0.41, 0.61)  (1 unrouted)
  Top 0.381: 32.26,42.67 32.26,43.43 T4.2 | 44.45,42.67 44.45,43.43 T3.2
  Top 0.406: U6.11 57.47,8.13 56.15,8.13 55.88,7.86 C14.P$1 55.65,7.38 R2.P$1
  Top 0.61: v45.72,6.1 C17.P$1 45.14,6.73 U3.5 | C22.P$2 88.77,44.06 U5.5
  Top 0.813: C12.P$1 22.61,42.06 22.61,42.16
  Top 1.27: IC1.3 IC1.6 22.61,42.16 v24.64,42.16 31.75,42.16 32.26,42.67 44.45,42.67 44.7,42.42 56.9,42.42 57.4,42.93 T1.2 58.42,42.42 69.09,42.42 73.91,47.24 88.39,47.24 88.4,47.23 C22.P$2 | R2.P$1 R3.P$1 v52.32,6.1
  Bottom 1.27: 65.28,6.1 69.85,6.1 JP1.1 | 65.28,6.1 63.5,6.1 | 63.5,6.1 v52.32,6.1 v45.72,6.1 44.2,7.62 34.29,7.62 24.64,17.27 v24.64,42.16 | R32.P$1 65.01,6.36 65.28,6.1 | R31.P$1 63.74,5.85 63.5,6.1
  other vias: 10.16,46.99 11.68,46.99 13.21,46.99 14.73,46.99 16.26,46.99 17.78,46.99 19.3,46.99 20.32,45.72 18.54,45.72 17.02,45.72 15.49,45.72 13.97,45.72 12.45,45.72 10.92,45.72 10.16,44.45 11.68,44.45 13.21,44.45 14.73,44.45 16.26,44.45 17.78,44.45 19.3,44.45 20.32,43.18 18.54,43.18 17.02,43.18 15.49,43.18 13.97,43.18 12.45,43.18 10.92,43.18 10.16,41.91 11.68,41.91 13.21,41.91 14.73,41.91 16.26,41.91 17.78,41.91 19.3,41.91 20.32,40.64 18.54,40.64 17.02,40.64 15.49,40.64 13.97,40.64 12.45,40.64 10.92,40.64 10.16,39.37 11.68,39.37 13.21,39.37 14.73,39.37 16.26,39.37 17.78,39.37 19.56,39.37 20.32,38.1 18.8,38.1 17.02,38.1 15.49,38.1 13.97,38.1 12.45,38.1 10.92,38.1
  pour Bottom (isolate 0.305, no thermals): 9.65,47.5 20.83,47.5 20.83,36.83 9.65,36.83
  pour Route15 (isolate 0.305, no thermals): 9.65,47.5 20.83,47.5 20.83,36.83 9.65,36.83
  pour Route2 (isolate 0.305, no thermals): 9.65,47.5 20.83,47.5 20.83,36.83 9.65,36.83
+24V
  pour Top (isolate 0.305, no thermals): 16.51,35.05 20.57,35.05 20.57,24.13 9.65,24.13 9.65,27.18 16.51,27.18
  pour Top (isolate 0.305, no thermals): 20.57,24.13 21.84,22.86 65.28,22.86 65.28,21.34 16.51,21.34 16.51,24.13
-8V  (via drill 0.61)
  Top 0.61: R19.P$1 | v17.27,5.59 23.24,5.59 23.24,7.49
  Top 1.27: T2.2 23.24,7.49 27.69,3.05 42.16,3.05 | R10.P$2 42.16,3.05 | 42.16,3.05 73.15,3.05 73.15,6.6 | 73.15,6.6 73.15,19.31 U4.P$4 | R19.P$1 73.15,6.6
  Bottom 0.61: D6.CATHODE v17.27,5.59
-24V
  Top 0.406: U1.EN 18.21,18.21 17.02,17.02
  Top 1.27: C9.P$1 10.89,17.04 8,19.94 | 8,19.94 5.23,22.7 JP3.1 | C19.P$2 8,19.97 8,19.94
  pour Top (no thermals): 23.11,16.26 23.11,15.24 16.76,15.24 16.76,16.51 15.24,16.51 15.24,17.53 17.78,17.53 17.78,16.26
AMP_POW  (via drill 0.61)
  Top 0.61: C18.P$2 U3.2 | C29.P$2 U8.2
  Top 0.813: 34.29,12.45 37.58,12.45 R5.P$2 43.18,12.43 | C18.P$2 43.19,12.43 43.18,12.43 | 43.18,12.43 v43.18,13.72 | C29.P$2 v80.01,18.03
  Top 1.27: C8.P$1 34.29,13.94 34.29,12.45 T2.3
  Bottom 0.813: v43.18,13.72 80.01,13.72 v80.01,18.03
  pour Top (isolate 0.305, no thermals): 25.91,16.26 27.43,16.26 27.43,16 33.27,16 33.27,15.24 25.91,15.24
GND  (via drill 0.3, 0.41, 3.05 pad 4.57, 3.68 pad 5.84)
  Top 0.254: 106.17,23.4 U2.6 U2.7 | U2.8 107.19,23.4 | U2.17 107.19,27.9 | 106.68,27.9 U2.18 U2.19 | U2.3 U2.2 | U2.23 U2.22
  Top 0.406: 58.67,11.94 58.74,11.94 U6.13
  other vias: 19.05,17.27 41.66,10.16 37.34,5.33 46.99,8.64 43.18,6.1 15.24,22.86 15.24,31.75 28.19,23.88 23.11,35.31 22.35,40.39 36.83,9.4 31.75,13.21 26.67,35.31 22.86,19.3 26.42,19.3 23.88,14.73 16,12.7 10.41,9.91 22.86,44.2 38.1,48.77 51.05,48.77 51.05,37.85 38.1,37.85 16,2.79 4.76,6.1 4.76,45.21 115.89,48.51 115.89,2.79 47.24,4.57 45.72,12.45 36.07,13.97 31.24,20.07 55.88,4.57 66.29,7.62 49.78,8.13 60.96,4.57 2.29,20.07 3.81,32.26 53.09,20.07 63.5,19.56 64.01,12.19 51.82,10.16 44.96,19.05 49.02,24.13 44.45,32 36.83,27.18 90.17,46.99 80.26,48.77 91.69,28.45 89.92,25.65 96.27,28.7 102.36,24.64 98.55,22.35 91.69,21.34 70.36,14.99 71.37,4.57 74.93,9.14 78.74,15.24 75.44,24.89 84.58,15.75 102.11,28.45 103.99,33.02 81.28,21.08 100.33,27.18 100.58,33.53 76.96,45.47 75.95,42.16 71.37,12.45 74.93,4.83 85.6,3.81 90.68,40.13 82.8,44.96 87.38,38.61 100.84,39.88 95.76,33.02 84.07,33.02 70.1,32.77 78.23,27.69 83.06,27.69 76.71,20.83 58.67,23.88 106.43,2.64 104.34,2.67 104.55,3.86 106.25,3.84 106.32,5.03 104.5,5.03 104.5,6.22 106.32,6.17 106.25,7.34 104.57,7.39 106.25,8.69 104.57,8.69 104.57,9.98 106.25,9.98 106.25,11.2 106.25,12.5 106.25,13.77 106.22,15.04 106.22,16.1 104.57,11.23 104.57,12.5 104.55,13.77 104.57,15.04 104.57,16.26 104.6,18.34 106.3,22.66 104.47,20.52 106.43,20.62 106.25,18.26 106.58,30.28 106.58,31.55 106.78,34.19 104.37,35.74 106.25,37.13 104.57,37.13 104.57,39.78 106.25,39.78 106.25,41.33 104.57,41.3 106.25,42.6 104.57,42.6 106.25,43.87 104.57,43.87 106.3,45.06 104.52,45.06 104.5,46.28 106.3,46.33 106.22,47.55 104.57,47.57 104.39,48.82 106.43,48.82 52.07,16.76 61.72,16.51 93.47,18.29 101.35,16.51 114.3,38.61 113.54,25.91 115.82,16.26 112.52,11.68 117.09,31.5 71.37,47.24 101.09,10.92 86.87,44.7 90.68,11.18 82.8,5.08 69.6,20.57 95.89,48.51 95.89,2.79 70.61,1.52 50.55,1.52 28.45,1.52 47.5,14.73 13.21,49.02 63.5,49.02 57.4,31.24 111,39.88 107.95,16.51 107.82,32.64 108.71,27.69 113.54,29.72 108.71,25.4 108.56,24.18 102.36,27.18 102.36,25.91 107.62,28.78 107.44,22.61 95.5,14.22 95.25,23.62 90.68,34.29 112.52,33.78 118.11,37.34 117.86,26.92 112.01,20.07 116.84,21.59 117.35,11.68 94.74,38.35 100.58,22.35 106.27,28.78 98.04,36.37 66.04,39.62 36.07,20.32 52.58,29.46 87.63,34.54 86.11,25.65 106.45,1.47 104.34,1.47 106.4,49.86 104.39,49.83 104.52,22.66 86.87,19.05 86.11,21.84 81.53,13.46 62.99,9.4 111,22.35 111.25,24.89 111.25,28.7 109.98,30.99 108.2,30.99 101.6,35.81 100.84,25.4 101.09,24.13 98.55,25.65 99.82,25.91 103.38,19.3 102.87,17.53 108.71,20.07 113.03,23.37 110.24,19.05 112.52,17.78 114.05,21.08 114.81,19.05 115.32,23.88 113.03,27.69 112.01,31.5 110.24,33.27 108.97,34.54 108.46,37.34 111.25,36.07 114.3,35.81 115.32,32.77 115.82,29.21 115.57,26.67 117.86,24.64 102.36,38.1 102.11,41.66 100.08,37.59 99.31,35.05 98.55,33.02 97.03,34.54 95.76,25.91 97.03,23.62 97.28,21.08 96.27,18.29 98.3,17.27 100.08,17.27 102.62,14.99 110.74,16.51 108.71,14.48 111.51,14.22 113.28,16 117.09,18.54 117.09,35.05 108.97,40.89 109.98,43.18 110.49,38.1 112.78,37.59 117.09,39.88 116.08,37.08 119.13,33.27 118.87,29.46 119.13,22.61 119.13,20.07 119.13,16.51 100.33,14.73 98.04,15.24 95.76,16.26 93.47,16.51 93.22,22.35 93.22,25.15 93.73,27.69 93.73,33.53 95,35.56 93.22,36.83 97.54,38.35 96.27,37.08 95,40.89 97.03,40.89 99.31,42.42 99.06,40.13 95.25,10.16 97.28,11.94 99.57,12.95 98.81,9.14 109.22,11.94 108.97,8.89 111.25,9.91 114.3,13.97 118.11,14.22 115.06,11.18 102.36,12.95 93.47,13.21 104.52,28.75 103.25,28.63 103.12,22.73 108.46,22.86 108.46,26.67 102.36,23.62 101.6,22.86 100.08,23.37 100.08,24.64 102.11,32.51 109.22,29.46 109.98,28.19 112.01,26.42 109.98,24.89 109.73,23.37 108.2,21.34 109.73,21.84 111.51,23.62 111.25,29.97 109.22,32.26 98.81,24.13 97.03,22.35 94.23,21.08 95.76,21.84 96.27,24.64 96.01,27.18 106.43,21.59 106.43,19.56 104.47,19.46 107.7,18.29 108.2,39.12 112.01,41.66 114.55,40.39 118.87,41.4 101.6,44.45 99.06,48.77 112.27,48.77 116.84,43.43 94.49,44.45 92.96,39.88 92.46,42.42 91.44,38.35 92.46,35.31 90.68,23.88 92.2,26.42 92.46,23.62 91.95,14.99 89.66,13.46 92.71,11.18 101.85,8.64 99.06,1.78 94.49,7.11 90.68,8.13 92.96,8.89 95.25,11.94 111,6.6 108.2,4.83 100.58,6.86 102.62,5.59 112.27,2.03 119.13,1.52 119.13,9.65 116.33,13.97 119.38,26.16 111.25,45.47 108.2,43.69 107.95,46.99 102.62,46.99 99.31,45.47 91.69,44.96 91.95,17.27 91.95,5.08 104.37,17.27 97.54,13.46 99.06,10.92 102.87,10.41 107.95,10.67 110.74,12.45 113.28,9.65 97.54,6.86 114.3,7.11 87.88,6.86 87.38,9.65 88.39,11.94 87.38,23.62 86.36,1.27 86.11,8.13 85.85,11.94 89.15,50.29 97.28,44.2 113.79,43.94 119.38,38.86 89.15,23.11 85.6,23.62 87.38,4.83 89.41,9.4 117.6,7.11 119.13,45.72 116.33,9.14 104.57,38.4 106.25,38.4 109.73,26.67 111.25,27.43 112.78,24.64 19.81,49.28 8.13,40.13 9.65,34.54 25.15,14.73
  pour Top (isolate 0.305, rank 2): 0,0 0,51.31 120.65,51.31 120.65,0
  pour Bottom (isolate 0.305, rank 2): 0,51.31 120.65,51.31 120.65,0 0,0
  pour Route2 (isolate 0.305, rank 2, no thermals): 0,51.31 120.65,51.31 120.65,0 0,0
  pour Route15 (isolate 0.305, rank 2, no thermals): 0,51.31 120.65,51.31 120.65,0 0,0
  pour Top (isolate 0.305, rank 2, no thermals): 107.7,35.05 106.43,35.05 106.43,36.58 107.7,36.58
  pour Top (isolate 0.305, rank 2, no thermals): 107.7,16.51 106.17,16.51 106.17,18.03 107.7,18.03
  pour Top (isolate 0.305, rank 2, no thermals): 23.5,18.54 27.69,18.54 27.69,18.03 25.65,18.03 25.65,16 23.5,16
N$1
  Top 0.406: IC1.2 13.72,33.83 C13.P$1 R1.P$2
N$2
  Bottom 0.61: U10.P$3 D1.CATHODE
N$3
  Bottom 0.61: D2.CATHODE 60.45,8.14 U9.P$3
N$4
  Top 0.406: JP1.2 R43.P$1
N$5
  Top 0.406: U6.14 59.37,7.86 C16.P$1
N$6
  Top 0.406: U6.15 60.01,9.33 60.97,8.37 R4.P$2
N$7
  Top 0.406: U6.12 58.1,7.67 C15.P$1
N$8
  Top 0.406: 48.26,10.41 44.13,10.41 U3.1 | 48.26,10.41 R12.P$1 | R11.P$2 48.26,10.41
N$9
  Top 0.61: R5.P$1 37.76,10.93 Q1.C 35.22,5.33 T2.1
N$10
  Top 0.61: Q1.B 40.12,6.92 R9.P$2
N$11  (via drill 0.61)
  Top 0.61: R13.P$2 T1.3 v59.94,29.21
  Bottom 0.61: R34.P$1 v59.94,29.21
N$12
  Top 0.406: 42.16,6.66 R10.P$1 46.2,5.07 R11.P$1
  Top 0.61: U3.4 42.16,6.66
N$13  (via drill 0.61)
  Top 0.61: R13.P$1 v64.77,32 | v75.69,22.1 U7.1
  Route15 0.61: v64.77,32 65.79,32 v75.69,22.1
N$14  (via drill 0.61)
  Top 0.61: R17.P$1 49.28,32 R16.P$2 T3.3 47.24,31.88 v47.24,29.21
  Bottom 0.61: R35.P$1 v47.24,29.21
N$15
  Top 0.406: U1.FB 28.7,16.91 C11.P$2 R6.P$1 R7.P$2
N$16  (via drill 0.61)
  Top 0.406: R16.P$1 v52.07,32 | v74.93,12.19 U4.P$1
  Route2 0.406: v52.07,32 55.12,32 v74.93,12.19
N$17
  Top 0.406: U1.NR/SS 21.07,17.56 C10.P$1
N$18
  Bottom 0.61: D1.ANODE R31.P$2
N$19
  Top 1.016: R19.P$2 77.72,8.39 R21.1
N$20  (1 unrouted)
  Top 1.016: R21.3 82.8,6.62
N$21  (via drill 0.61)
  Top 0.61: T4.3 R22.P$2 | R22.P$2 R23.P$1 | v36.83,33.27 R22.P$2
  Bottom 0.61: R33.P$1 v36.83,33.27
N$22
  Top 0.61: R22.P$1 36.83,29.46 JP2.1
N$23
  cutout Top (no thermals): 103.76,29.08 104.78,29.08 104.78,32.13 103.76,32.13
N$24
  Top 0.61: U5.3 81.79,40.96 | 81.79,40.96 T5.2 | T5.4 81.79,40.96 | 86.61,40.83 U5.3 | R25.P$2 86.11,40.58 U5.3
N$25
  Top 0.61: R27.P$2 85.59,43.76 U5.1
N$26
  Top 0.61: T5.1 84.09,43.48 R27.P$1
N$27
  Top 0.61: R25.P$1 R29.P$1
N$28
  Top 0.61: R28.P$1 79.48,45.22 T5.3 74.47,43.48 X3.1
N$29
  Top 0.61: U5.4 88.9,40.96 R26.P$1
N$30
  Top 0.381: J1.P$1 C23.P$1
N$31
  Top 0.381: C24.P$2 J2.P$1
N$32
  Top 0.61: C5.P$1 88.65,17.16 R38.P$1 87.27,17.16 R37.P$1 87.04,17.08 U8.4
N$33
  Top 0.381: L1.P$2 105.42,34.44 C25.P$1 C23.P$2
N$34
  Top 0.152: U2.21 105.18,27.9 | 105.18,27.9 105.18,27.74 105.66,27.74 U2.20 | 105.18,27.9 105.41,27.9
  Top 0.381: L1.P$1 105.41,32.61 L3.P$1 105.41,27.9
N$35
  Top 0.381: L2.P$1 105.42,19.06 C26.P$1 C24.P$1
N$36
  cutout Top (no thermals): 87.12,29.08 87.76,29.08 87.76,30.86 87.25,30.86 87.12,30.86
N$37
  Bottom 0.61: R32.P$2 D2.ANODE
N$38
  Bottom 0.61: R34.P$2 D4.ANODE
N$39
  Bottom 0.61: R33.P$2 D3.ANODE
N$40
  Bottom 0.61: R35.P$2 D5.ANODE
N$41
  Bottom 0.61: D6.ANODE R36.P$2
N$42
  cutout Top (no thermals): 104.39,33.15 106.43,33.15 106.43,33.91 104.39,33.91
N$43
  Top 0.61: C27.P$2 81.8,16.49 R30.P$2 82.35,17.08 U8.3
N$44
  Top 0.406: U6.16 60.7,10.55 C28.P$1 64.14,10.55 R43.P$2 64.27,9.02 R42.P$2
RF_DET  (via drill 0.61)
  Top 0.406: U6.4 58.74,19.3 v58.67,19.3 | 38.86,29.21 arc90 38.61,28.96
  Top 0.61: R23.P$2 38.61,28.96 R24.P$1 | v40.13,29.21 38.86,29.21
  Route15 0.406: v58.67,19.3 57.66,18.29 49.78,18.29 40.13,27.94 v40.13,29.21
RF_EN  (via drill 0.61)
  Top 0.406: T4.1 v29.21,28.96 | v54.36,15.49 56.2,15.49 U6.8
  Route2 0.406: v29.21,28.96 29.21,24.64 38.35,15.49 v54.36,15.49
V_GATE
  Top 0.152: U2.4 105.16,23.55 arc-90 105.18,23.57 105.49,23.57 arc-90 U2.5 105.4,23.4
  Top 0.381: 105.4,23.4 R8.P$2 L2.P$2
V_PINCH
  Top 0.61: R21.2 80.28,10.17 R30.P$1 78.87,16.51 78.87,17.91 U4.P$3
VDD
  pour Top (isolate 0.305, no thermals): 62.23,26.67 65.28,26.67 65.28,27.69 66.29,28.7 83.31,28.7 84.07,29.46 86.87,29.46 86.87,31.75 66.29,31.75 62.23,27.69
VDD_2
  pour Top (isolate 0.305, no thermals): 88.14,31.75 88.14,29.46 103.63,29.46 103.63,31.75
VDD_DET  (via drill 0.61)
  Top 0.406: v62.23,18.03 60.96,18.03 60.01,17.08 U6.2
  Top 0.61: R14.P$2 R15.P$2 v59.69,25.4
  Route15 0.406: v59.69,25.4 62.23,22.86 v62.23,18.03
VDD_EN  (via drill 0.61)
  Top 0.406: T1.1 v54.86,28.96 | U6.6 57.47,17.78 54.86,17.78 v54.86,19.56
  Route2 0.406: v54.86,28.96 v54.86,19.56
VGG
  Top 1.016: R8.P$1 102.36,21.59 102.36,19.81 100.33,19.81 C7.P$1 C4.P$1 90.03,19.82 R39.P$2 90.03,18.66 R38.P$2
VGG_DET  (via drill 0.61)
  Top 0.406: v60.45,19.3 59.37,18.23 U6.3
  Top 0.61: R17.P$2 R18.P$1 v51.05,27.67 v51.05,27.69
  Route15 0.406: v51.05,27.69 52.07,27.69 v60.45,19.3
VGG_EN  (via drill 0.61)
  Top 0.406: T3.1 41.91,32 v41.91,28.96 | v53.85,17.02 56.83,17.02 U6.7
  Route2 0.406: v41.91,28.96 v53.85,17.02
VL
  Top 0.61: R26.P$2 88.9,32.81 R29.P$2
VMID
  Top 0.61: U8.1 83.19,20.32 R39.P$1 88.53,18.9 C5.P$2
VPIN_DET  (via drill 0.61)
  Top 0.406: R12.P$2 50.29,10.43 v50.29,12.45 | v62.48,14.99 62.05,15.42 U6.1
  Route15 0.406: v50.29,12.45 59.94,12.45 v62.48,14.99
VPIN_EN  (via drill 0.61)
  Top 0.406: Q1.E 40.13,8.99 v40.13,10.67 | U6.5 58.1,18.1 v56.64,19.56
  Route2 0.406: v40.13,10.67 40.64,11.18 56.64,11.18 v56.64,19.56

### Text on the board
bPlace: RF out | Documentation at: / https://git.io/vMvf3 | RF enabled | Idd Monitor | GND | RF enable | 1 V/A | Vdd on | -24V | +24V | Vgg on | GND | +5V | Install heatsink on pad | Vpinch on | Sequencing | On/Off | Set for quiescent / Idd = 100 mA | No Fault | connect to front / rocker switch | RF in